# EAGLE design Intar_IR_LED_Module (EAGLE 7.3.0)
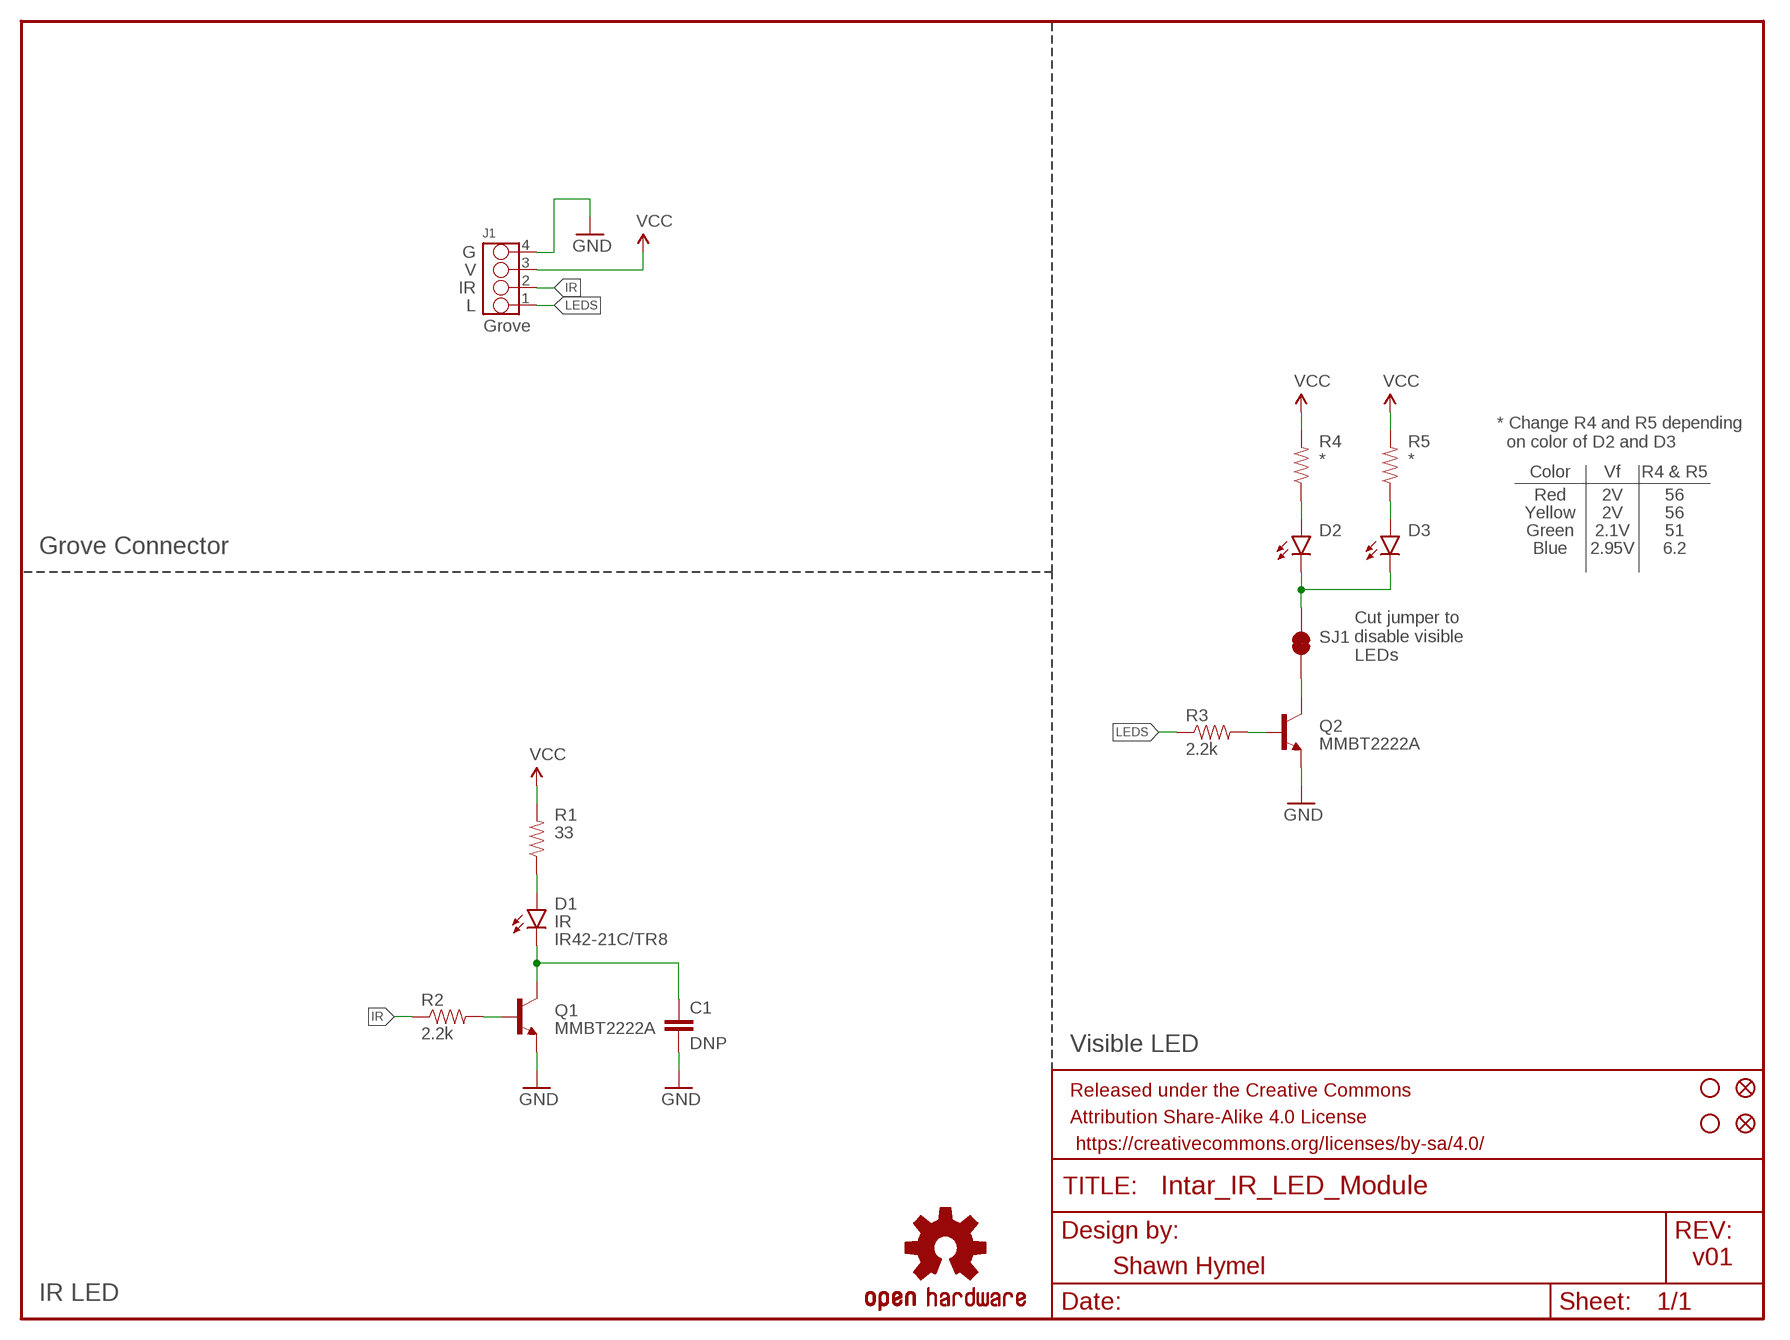
[diagram p0: schematic, sheet 1]

## Parts
C1  DNP  10NF/10000PF-50V-10%(0603)  [0603-CAP]
D1  IR  LEDIR42-21C/TR8  [IR42-21C/TR8]
D2  LED0603  [LED-0603]
D3  LED0603  [LED-0603]
FID1  FIDUCIAL1X2  [FIDUCIAL-1X2]
FID2  FIDUCIAL1X2  [FIDUCIAL-1X2]
FRAME1  FRAME-LETTER  [CREATIVE_COMMONS]
J1  GROVE-4P-2.0-3470130P1  [4P-2.0]
LOGO1  OSHW-LOGOS  [OSHW-LOGO-S]
Q1  MMBT2222A  TRANSISTOR_NPNMMBT2222A  [SOT23-3]
Q2  MMBT2222A  TRANSISTOR_NPNMMBT2222A  [SOT23-3]
R1  33  RESISTOR0603-RES  [0603-RES]
R2  2.2k  2.2KOHM-1/10W-1%(0603)  [0603-RES]
R3  2.2k  2.2KOHM-1/10W-1%(0603)  [0603-RES]
R4  *  RESISTOR0603-RES  [0603-RES]
R5  *  RESISTOR0603-RES  [0603-RES]
SJ1  JUMPER-PAD-2-NC_BY_TRACE  [PAD-JUMPER-2-NC_BY_TRACE_YES_SILK]
STANDOFF1  STAND-OFF  [STAND-OFF]
STANDOFF2  STAND-OFF  [STAND-OFF]

## Nets
GND: C1.2 J1.4 Q1.2(E) Q2.2(E)
IR: J1.2 R2.1
LEDS: J1.1 R3.1
N$1: Q1.1(B) R2.2
N$2: D1.A R1.1
N$3: C1.1 D1.C Q1.3(C)
N$4: D2.C D3.C SJ1.2
N$5: Q2.1(B) R3.2
N$6: D2.A R4.1
N$7: D3.A R5.1
N$8: Q2.3(C) SJ1.1
VCC: J1.3 R1.2 R4.2 R5.2

## Notes on the sheet
- G
- V
- IR
- L
- Grove
- * Change R4 and R5 depending
    on color of D2 and D3
- Color | Vf | R4 & R5
- Red | 2V | 56
- Yellow | 2V | 56
- Green | 2.1V | 51
- Grove Connector | Blue | 2.95V | 6.2
- Cut jumper to
  disable visible
  LEDs
- Visible LED
- v01
- Shawn Hymel
- IR LED

## Library data of the parts
C1 = SparkFun-Capacitors:10NF/10000PF-50V-10%(0603): CAP-00867; PROD_ID: CAP-00867; VALUE: 10nF
D1 = Intar_Eagle_Library:LED; MFG_NAME: IR42-21C/TR8
D2 D3 = SparkFun-LED:LED: LEDs Standard schematic elements and footprints for 5mm, 3mm, 1206, and 0603 sized LEDs. 5mm - Spark Fun Electronics SKU : COM-00529 (and others)
FID1 FID2 = SparkFun-Aesthetics:FIDUCIAL: Fiducial Alignment Points Various fiducial points for machine vision alignment.
FRAME1 = SparkFun-Aesthetics:FRAME-LETTER: Schematic Frame Standard 8.5x11 US Letter frame
J1 = Connector:GROVE-4P-2.0
LOGO1 = SparkFun-Aesthetics:OSHW-LOGO: Open Source Hardware Logo This logo indicates the piece of hardware it is found on incorporates a OSHW license and/or adheres to the definition of open source hardware found here: http://freedomdefined.org/OSHW
Q1 Q2 = SparkFun-DiscreteSemi:TRANSISTOR_NPN: Generic NPN BJT MMBT2222A - TRANS-08049 (SOT-23, 1A 40V) MPSA42 - TRANS-09116 (SOT-23, 500mA 300V) MMBT5088LT1G - TRANS-11160 (SOT-23, 50 mA 30V) BC547 - COM-08928 <http://www.sparkfun.com/products/8928> (TO-92 45V 100mA) (1.Collector 2.Base 3.Emitter) 2N3904 - COM-00521 <http://www.sparkfun.com/products/521> (TO-92 40V 200mA) (1.Emitter 2.Base 3.Collector) P2N2222A - COM-12852 <http://www.sparkfun.com/products/12852> (TO-92 40V 600mA) (1.Collector 2.Base 3.Emitter); PROD_ID: TRANS-08049
R1 R4 R5 = SparkFun-Resistors:RESISTOR: Resistor Basic schematic elements and footprints for 0603, 1206, and PTH resistors.
R2 R3 = SparkFun-Resistors:2.2KOHM-1/10W-1%(0603): RES-08272; PROD_ID: RES-08272
SJ1 = SparkFun-Passives:JUMPER-PAD-2-NC_BY_TRACE
STANDOFF1 STANDOFF2 = SparkFun-Electromechanical:STAND-OFF: #4 Stand Off This is the mechanical footprint for a #4 phillips button head screw. Use the keepout ring to avoid running the screw head into surrounding components. SKU : PRT-00447

## Board
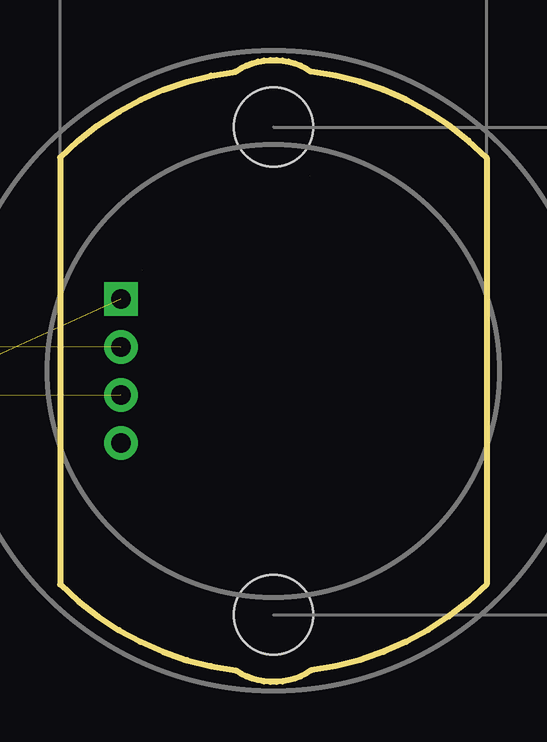
[diagram p1: board, top side]
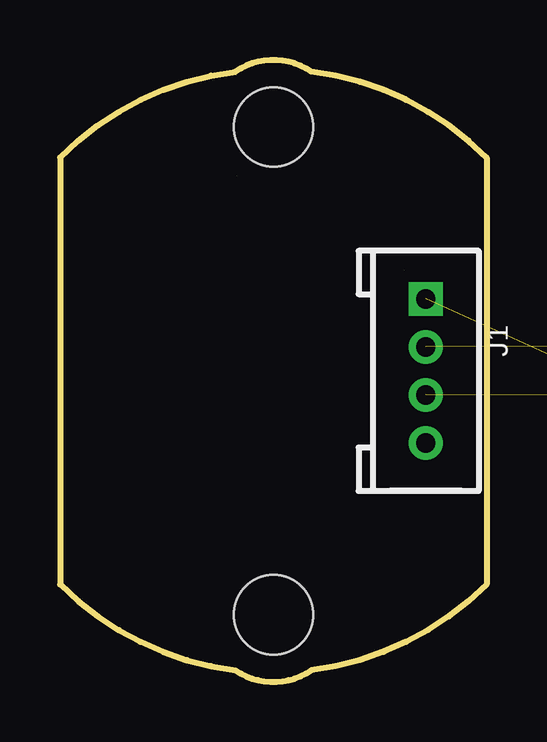
[diagram p2: board, bottom side, seen from below]

Size 17.78 x 25.91 mm. Coordinates in mm from the lower left corner, seen from the top.
Outline: 17.78,21.85 17.78,4.07 arc-38 10.46,0.48 arc-69 7.32,0.48 arc-38 0,4.07 0,21.85 arc-38 7.32,25.43 arc-69 10.46,25.43 arc-38 17.78,21.85
Copper layers (1*16): Top 0.035mm / dielectric 1.5mm / Bottom 0.035mm
Design rules "SparkFun-2-layer": minimum track width 7mil, minimum drill 15mil, track to track 8mil, track to pad 8mil, pad to pad 8mil, via to via 8mil, smd to smd 8mil, copper to edge 8mil, drill to drill 8mil, minimum pad ring 12mil, minimum via ring 10mil, stop-mask expansion 4mil, vias tented up to drill 20mil, thermal gap 10mil

### Footprints (pad centres in the part's own frame; a part is rotated, then mirrored left to right if it is on the bottom)
0603-CAP = smd 1.1 x 1: 1 -0.85,0; 2 0.85,0
IR42-21C/TR8 = smd 2.5 x 2.5: A 0,-2.25; C 0,2.25
LED-0603 = smd 1 x 1: A 0,-0.877; C 0,0.877
FIDUCIAL-1X2 = smd 1 x 1: 1 0,0
4P-2.0 = drill 0.8 pad 1.27 square: 1 -3,0 | drill 0.8 pad 1.27: 2 -1,0; 3 1,0; 4 3,0
SOT23-3 = smd 0.8 x 0.9: 1 -0.95,-1; 2 0.95,-1; 3 0,1.1
0603-RES = smd 1.1 x 1: 1 -0.85,0; 2 0.85,0
PAD-JUMPER-2-NC_BY_TRACE_YES_SILK = smd 0.635 x 1.27: 1 -0.508,0; 2 0.508,0
STAND-OFF = hole 3.302: 0,0

### Placement (x,y rotation side)
C1  -10.16,14.86 270 top  (outside the outline)
D1  -16.51,12.96 0 top  (outside the outline)
D2  -19.05,12.96 0 top  (outside the outline)
D3  -13.97,12.96 0 top  (outside the outline)
FID1  -16.51,19.31 0 top  (outside the outline)
FID2  -13.97,9.78 0 top  (outside the outline)
FRAME1  -24.13,-9.9 0 top  (outside the outline)
J1  2.54,12.96 270 bottom
LOGO1  -37.46,8.64 0 bottom  (outside the outline)
Q1  -19.68,18.04 270 top  (outside the outline)
Q2  -13.34,18.04 90 top  (outside the outline)
R1  -22.86,11.05 90 top  (outside the outline)
R2  -22.86,14.86 90 top  (outside the outline)
R3  -10.16,11.05 90 top  (outside the outline)
R4  -20.95,12.96 90 top  (outside the outline)
R5  -12.06,12.96 90 top  (outside the outline)
SJ1  -16.51,18.67 0 bottom  (outside the outline)
STANDOFF1  8.89,2.8 0 top
STANDOFF2  8.89,23.12 0 top

### Tracks (layer width: path | path; a pad name or v marks a point on that pad's centre or on a via)
GND  (via drill 0.38)  (2 unrouted)
  other vias: -10.92,7.75
IR  (1 unrouted)
LEDS  (1 unrouted)
N$1  (1 unrouted)
N$2  (1 unrouted)
N$3  (2 unrouted)
N$4  (2 unrouted)
N$5  (1 unrouted)
N$6  (1 unrouted)
N$7  (1 unrouted)
N$8  (1 unrouted)
VCC  (3 unrouted)

### Text on the board
tPlace: R2 | D1 | C1 | Q1 | Q2 | R4 | D2 | D3 | R5 | R1 | R3 | G | V | IR | L
bPlace: Visible / LEDs | Intar / IR LED Module | G | V | IR | L | v01
tDocu: Shawn Hymel